# Altium schematic sheet 02.SchDoc
size 513 x 386 mm
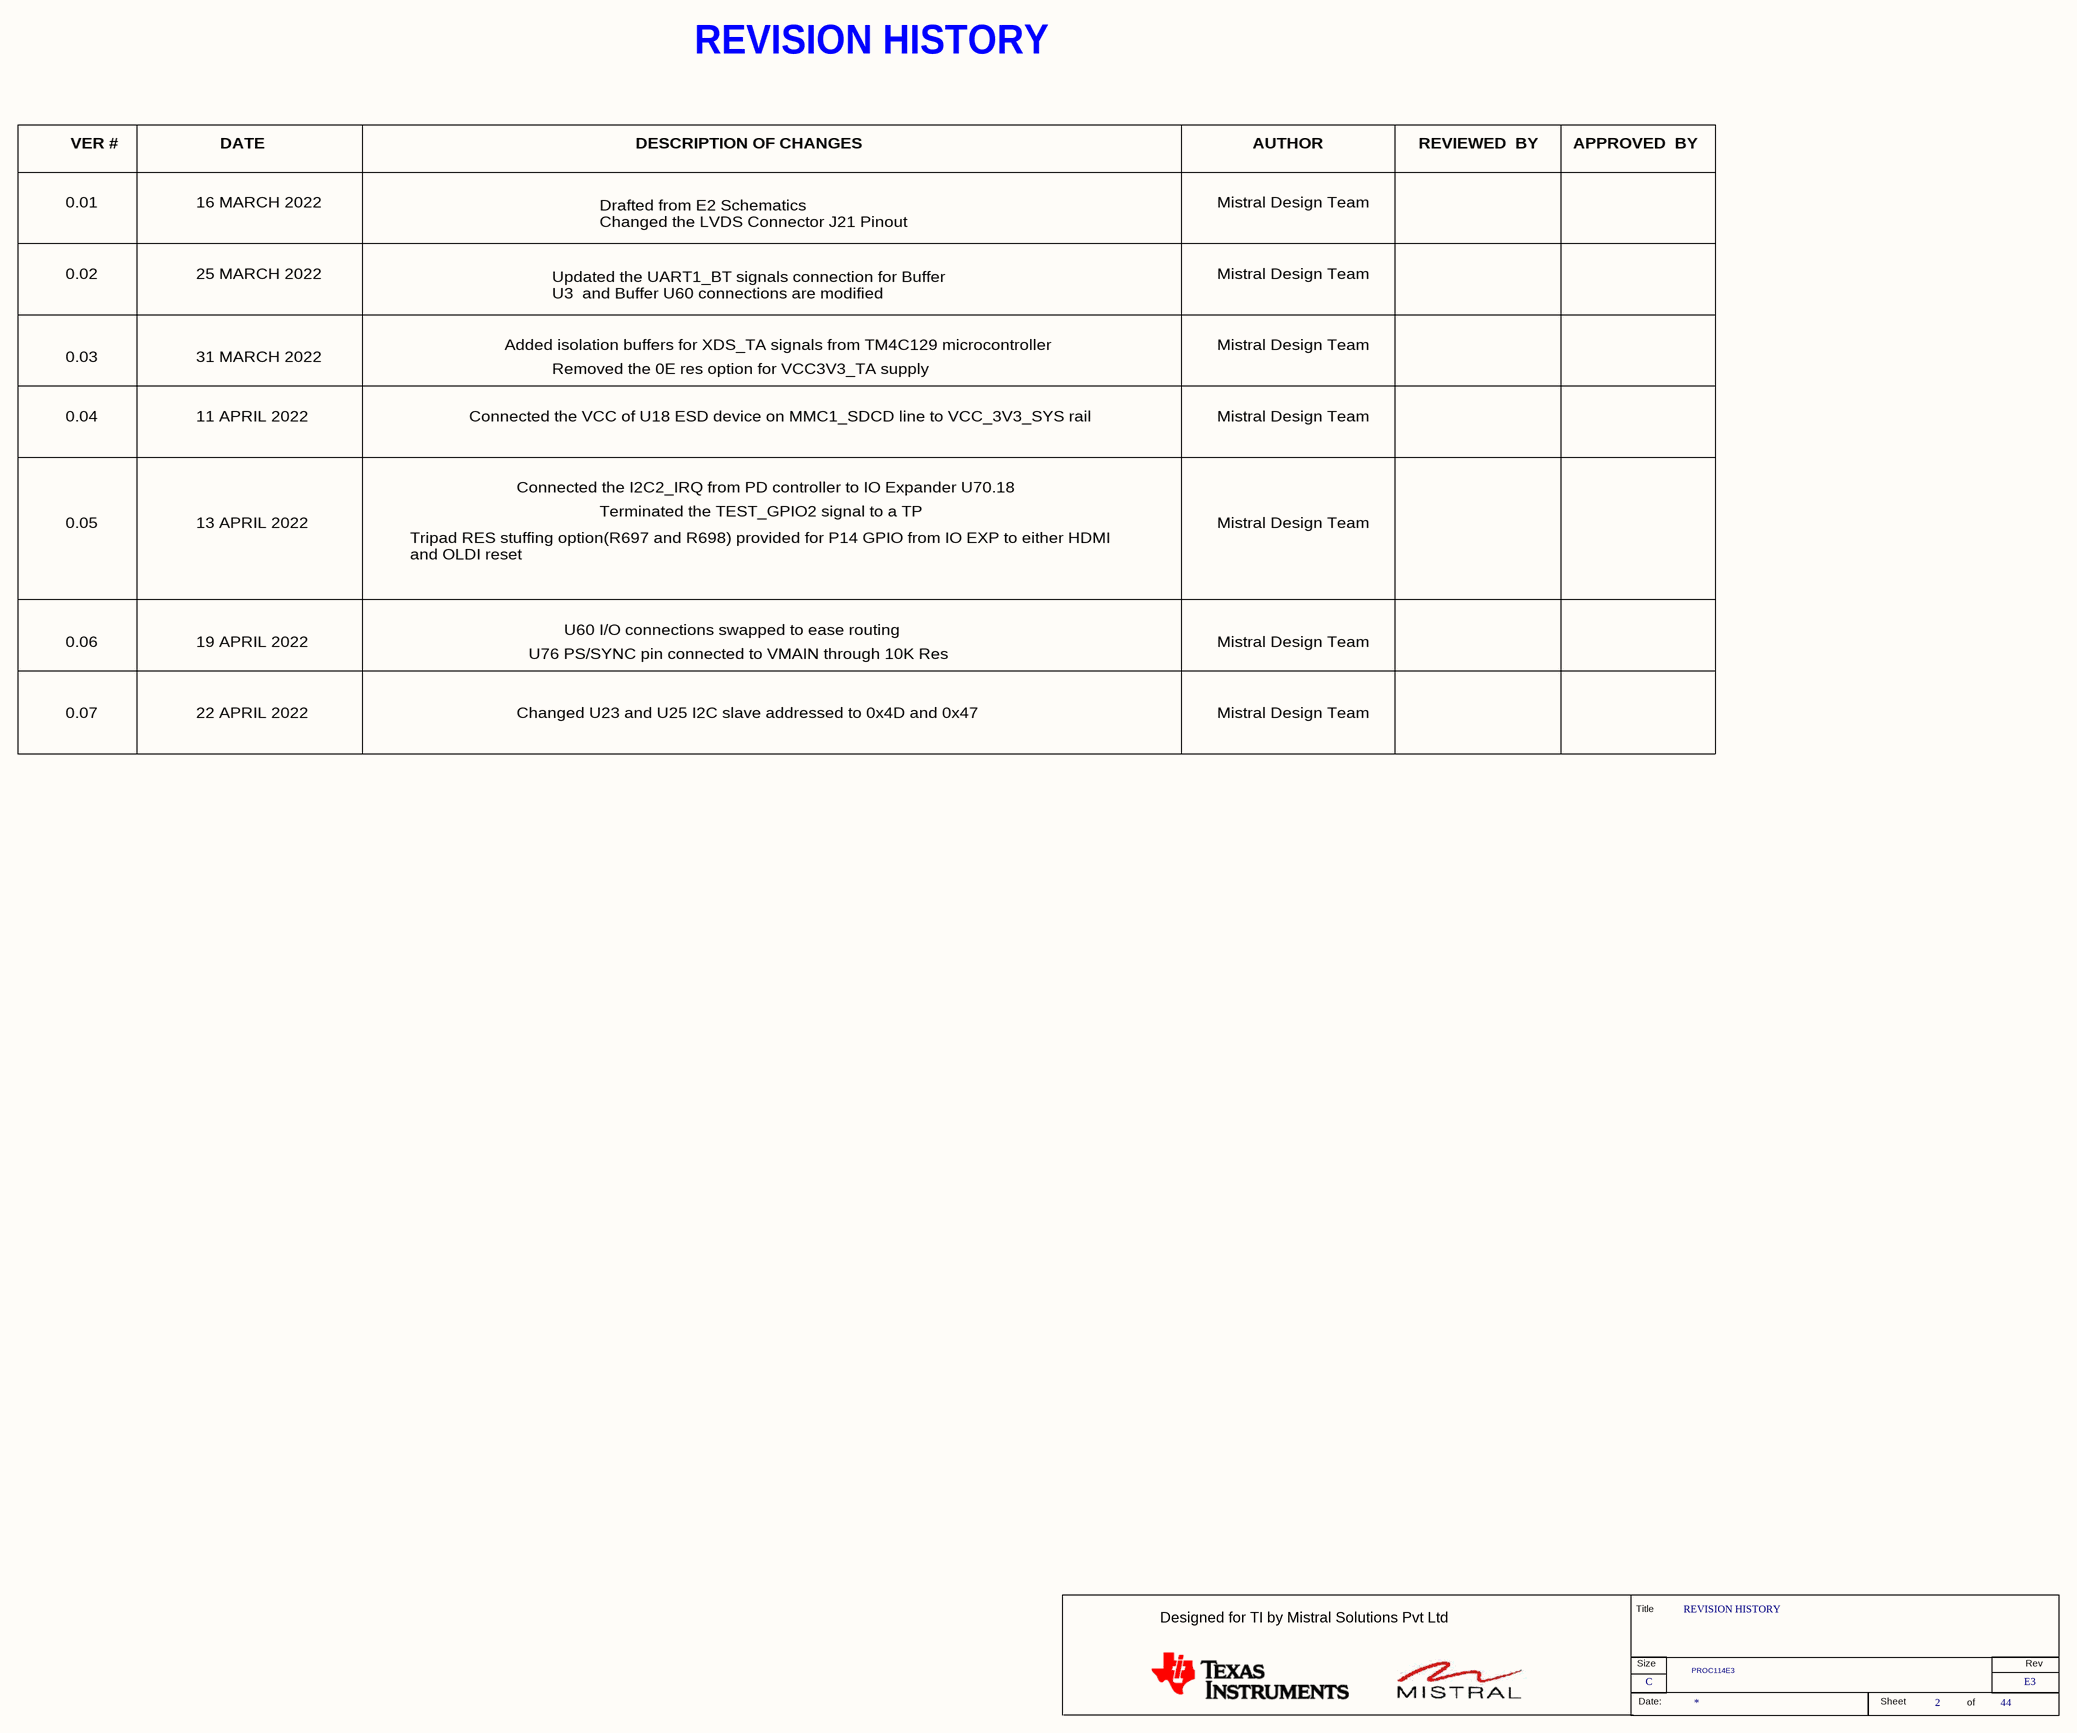
[diagram p0: 02.SchDoc]

## Parts
*  RevCode: E3  Title: REVISION HISTORY  Page Size: C  Page Number: 2  Page Count: 44  Variant Name: PROC114E3  (hidden comment: MISTRAL_TITLEBLK_CSIZE)  (graphical)

## Notes on the sheet
- REVISION HISTORY
- VER #
- DATE
- DESCRIPTION OF CHANGES
- AUTHOR
- REVIEWED  BY
- APPROVED  BY
- 0.01
- 16 MARCH 2022
- Drafted from E2 Schematics
  Changed the LVDS Connector J21 Pinout
- Mistral Design Team
- Updated the UART1_BT signals connection for Buffer
  U3  and Buffer U60 connections are modified
- 0.02
- 25 MARCH 2022
- 0.03
- 31 MARCH 2022
- Added isolation buffers for XDS_TA signals from TM4C129 microcontroller
- Removed the 0E res option for VCC3V3_TA supply
- 0.04
- 11 APRIL 2022
- Connected the VCC of U18 ESD device on MMC1_SDCD line to VCC_3V3_SYS rail
- Connected the I2C2_IRQ from PD controller to IO Expander U70.18
- 0.05
- 13 APRIL 2022
- Tripad RES stuffing option(R697 and R698) provided for P14 GPIO from IO EXP to either HDMI
  and OLDI reset
- Terminated the TEST_GPIO2 signal to a TP
- 0.06
- 19 APRIL 2022
- U76 PS/SYNC pin connected to VMAIN through 10K Res
- U60 I/O connections swapped to ease routing
- 0.07
- 22 APRIL 2022
- Changed U23 and U25 I2C slave addressed to 0x4D and 0x47
- (in symbol MISTRAL_TITLEBLK_CSIZE) Title; Designed for TI by Mistral Solutions Pvt Ltd; Size; Rev; Date:; Sheet; of

## Library data of the parts
* = MISTRAL_TITLEBLK_CSIZE: Issue: 1.0; Page Create Date: March  8, 1995; Page Modify Date: *; Schematic Page Count: 44; Schematic Page Number: 2